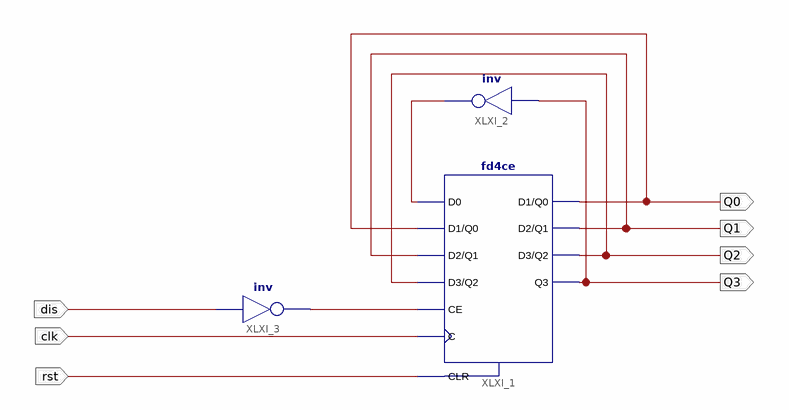
[diagram p0: schematic sheet 1]
// Xilinx ISE schematic koderJohnson.sch (spartan3e) as structural Verilog: 3 symbols, 7 ports
module koderJohnson (
  input  clk,
  input  rst,
  input  dis,
  output Q3,
  output Q2,
  output Q1,
  output Q0
);

  wire XLXN_11, XLXN_23;

  fd4ce XLXI_1 (
    .C(clk), .CE(XLXN_23), .CLR(rst), .D0(XLXN_11), .D1(Q0), .D2(Q1), .D3(Q2), .Q0(Q0), .Q1(Q1), .Q2(Q2),
    .Q3(Q3));
  not XLXI_2 (XLXN_11, Q3);
  not XLXI_3 (XLXN_23, dis);
endmodule
